# Altium project BMS.PrjPcb (part 2 of 2)

## Sheet Connectors.SchDoc: Connectors
size Letter; DrawnBy: Ayesha Ebrahim; Organization: UW Robotics; Address1: 200 University Avenue; Address2: Waterloo; Address3: Ontario; Address4: Canada N2L 3G6; SheetNumber: 2; SheetTotal: 6
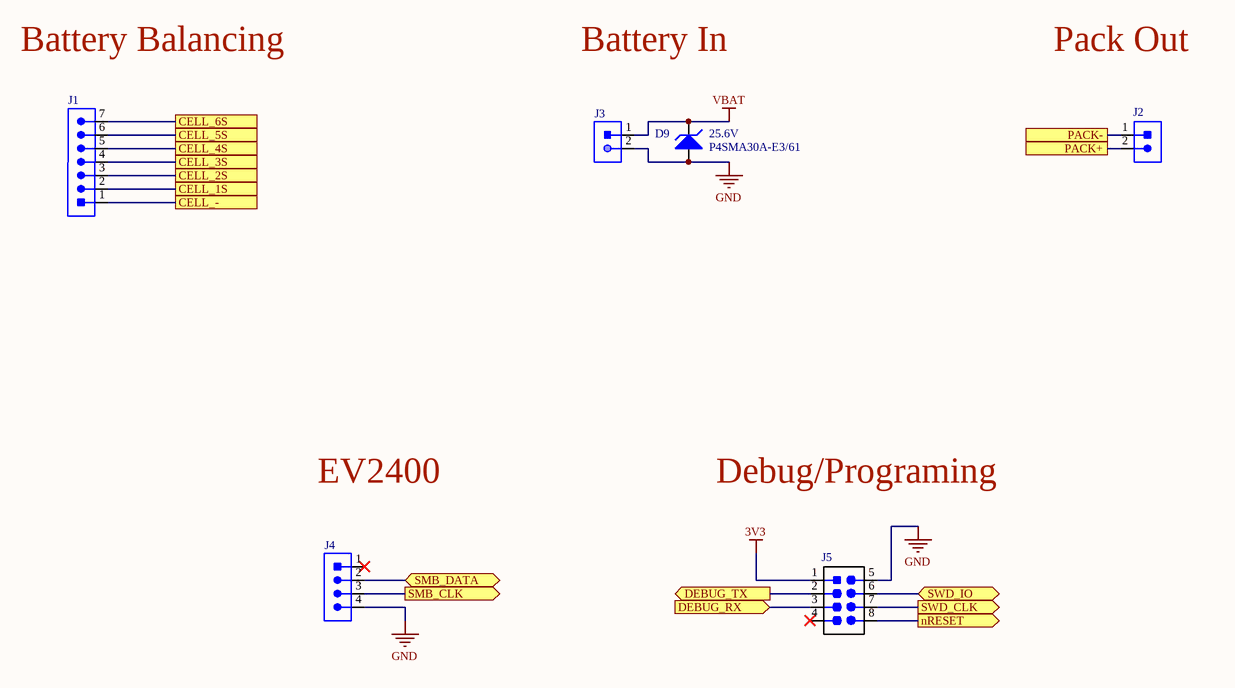
[diagram p3: Connectors.SchDoc]

### Parts
D9  Reverse Standoff Voltage: 25.6V  [DO-214AC_UNI]  (hidden comment: P4SMA30A-E3/61)
J1  CON_7M_TH_RA  [JST_S7B-XH-A(LF)(SN)]  (value not drawn)
J2  SCREW_TERM_115A  [MOLEX-0399200302]  (value not drawn)
J3  XT90  [XT90]  (value not drawn)
J4  CON_4M_TH_RA  [MOLEX-22-05-3041_V]  (value not drawn)
J5  HEADER 4X2  [HEADER_2X4]  (value not drawn)

### Ports
CELL_1S, CELL_2S, CELL_3S, CELL_4S, CELL_5S, CELL_6S, CELL_-, DEBUG_RX (in), DEBUG_TX (out), nRESET (out), PACK+, PACK-, SMB_CLK (out), SMB_DATA (bidir), SWD_CLK (out), SWD_IO (bidir)

### Nets
3V3: J5.1(VCC)
GND: D9.1 J1.1 J3.2 J4.4 J5.5(GND) ; port CELL_-
VBAT: D9.2 J1.7 J3.1 ; port CELL_6S
CELL_1S: J1.2 ; port CELL_1S
CELL_2S: J1.3 ; port CELL_2S
CELL_3S: J1.4 ; port CELL_3S
CELL_4S: J1.5 ; port CELL_4S
CELL_5S: J1.6 ; port CELL_5S
DEBUG_RX: J5.3 ; port DEBUG_RX
DEBUG_TX: J5.2 ; port DEBUG_TX
nRESET: J5.8 ; port nRESET
PACK+: J2.2 ; port PACK+
PACK-: J2.1 ; port PACK-
SMB_CLK: J4.3 ; port SMB_CLK
SMB_DATA: J4.2 ; port SMB_DATA
SWD_CLK: J5.7 ; port SWD_CLK
SWD_IO: J5.6 ; port SWD_IO

Not connected (* = marked no-connect by the designer): J4 1*; J5 4*

### Notes on the sheet
- Battery Balancing
- Battery In
- Pack Out
- EV2400
- Debug/Programing
- Title
- Size:
- Date:
- Letter
- Drawn By:
- Sheet
- of
- File:

### Library data of the parts
D9 = P4SMA30A-E3/61: TVS DIODE, 400W, 25.6V, UNI, DO-214AC; Manufacturer 1: Vishay Semiconductors; Element Configuration: Single; Leakage Current: 1uA; Direction: Unidirectional; Reverse Breakdown Voltage: 28.5V; Max Surge Current: 40A; Number of Unidirectional Channels: 1; Clamping Voltage: 41.4V; Power Line Protection: No; Test Current: 1mA; Peak Pulse Current: 9.7A; Supplier 1: Digi-Key; RoHS: Yes; Category: TVS Diodes; Stock 1: 1849; Pricing 1: 1=0.35000, 10=0.28400, 25=0.26000, 100=0.16340, 250=0.16152, 500=0.15126 (USD); Mount: Surface Mount; Case/Package: SMA; Number of Pins: 2; Min Operating Temperature: -65°C; Max Operating Temperature: 150°C; Max Power Dissipation: 400W; Composition: Zener; Packaging: Tape and Reel; Package Quantity: 1800; Operating Supply Voltage: 25.6V; Polarity: Unidirectional; Min Breakdown Voltage: 28.5V; Peak Pulse Power: 400W; Breakdown Voltage: 28.5V; Number of Channels: 1; Max Reverse Leakage Current: 1uA; Number of Elements: 1; ComponentLink1URL: https://datasheet.ciiva.com:443/pdfs/VipMasterIC/IC/VISH/VISH-S-A0008073361/VISH-S-A0008073361-1.pdf?src-supplier=IHS+Markit; ComponentLink1Description: https://datasheet.ciiva.com:443/pdfs/VipMasterIC/IC/VISH/VISH-S-A0008073361/VISH-S-A0008073361-1.pdf?src-supplier=IHS+Markit; ComponentLink2URL: https://datasheet.ciiva.com/343/p4sma-343073.pdf?src-supplier=Digi-Key; ComponentLink2Description: https://datasheet.ciiva.com/343/p4sma-343073.pdf?src-supplier=Digi-Key; Supplier Part Number 1: P4SMA30A-E3/61GICT-ND; Manufacturer Part Number 1: P4SMA30A-E3/61
J1 = CON_7M_TH_RA: CONN HEADER XH SIDE 7POS 2.5MM; Manufacturer 1: JST Sales America Inc.; Manufacturer Part Number 1: S7B-XH-A(LF)(SN); Current Rating: 3A; Voltage Rating: 250V; Contact Resistance: 10mR; Gender: Male; Number of Positions: 7; Insulation Resistance: 1GR; Connector Type: Header,Male Pin; Wire/Cable Gauge: 22AWG; Supplier 1: Digi-Key; RoHS: Yes; Category: Headers and Wire Housings; Pricing 2: 10=1.05000, 100=0.92700, 500=0.83300, 1000=0.81300, 5000=0.74700, 10000=0.69900 (CAD); Mount: Through Hole; Contact Material: Brass; Contact Plating: Tin,Lead; Color: Natural; Contact Shape: Square; Insulation Material: Nylon; Insulation Color: Natural; Min Operating Temperature: -25°C; Max Operating Temperature: 85°C; Number of Rows: 1; Voltage Rating (AC): 250V; Package Quantity: 250; Packaging: Bulk; Orientation: Right Angle; Fastening Type: Detent; Termination: Solder; Number of Contacts: 7; Pitch: 2.5mm; Lead Pitch: 2.5mm; REACH SVHC: No SVHC; Flammability Rating: UL94 V-0; Lead Free: Lead Free; ComponentLink1URL: https://datasheet.ciiva.com/726/exh-726397.pdf?src-supplier=Digi-Key; ComponentLink1Description: https://datasheet.ciiva.com/726/exh-726397.pdf?src-supplier=Digi-Key; ComponentLink2URL: https://datasheet.ciiva.com/8052/5448-8052233.pdf?src-supplier=Element14; ComponentLink2Description: https://datasheet.ciiva.com/8052/5448-8052233.pdf?src-supplier=Element14; ComponentLink3URL: https://datasheet.ciiva.com/16484/exh-16484539.pdf?src-supplier=Future+Electronics; ComponentLink3Description: https://datasheet.ciiva.com/16484/exh-16484539.pdf?src-supplier=Future+Electronics; Supplier Part Number 1: 455-2240-ND
J2 = SCREW_TERM_115A: CONN TERM BLOCK 2POS 15MM 1-8AWG; Manufacturer 1: Molex; Manufacturer Part Number 1: 0399200302; Plating: Brass,Bronze,Tin; Number of Levels: 1; Number of Positions Per Level: 2; Current: 115A; Voltage: 600V; Pitch: 0.591inch; Wire Gauge (Max): 8AWG; Wire Gauge (Min): 1AWG; Supplier 1: Digi-Key; Supplier Part Number 1: WM20114-ND; RoHS: Yes; Category: Terminal Blocks; Stock 2: 268; Pricing 2: 1=9.66000, 10=8.27400, 25=7.89600, 50=7.09800, 100=6.72000, 250=6.09000, 500=5.67000, 1000=5.35500, 5000=5.04000 (USD); Mount: Through Hole; Housing Material: Polybutylene; Contact Material: Copper; Color: Black; Contact Plating: Copper,Tin,Bright; Housing Color: Black; Min Operating Temperature: -40°C; Max Operating Temperature: 130°C; Termination: Solder; Packaging: Bulk; Number of Rows: 1; Orientation: Straight; Number of Circuits: 2; Number of Contacts: 2; Max Supply Voltage (AC): 600V; Max Voltage Rating (AC): 600V; Length: 32mm; Depth: 20.32mm; Radiation Hardening: No; ComponentLink1URL: https://datasheet.ciiva.com/6751/399200305-sd-6751818.pdf?src-supplier=Digi-Key; ComponentLink1Description: https://datasheet.ciiva.com/6751/399200305-sd-6751818.pdf?src-supplier=Digi-Key
J3 = XT90: HIGH QUALITY GOLD PLATED XT90 MA; Manufacturer 1: DFRobot; Manufacturer Part Number 1: FIT0588; Supplier 1: Digi-Key; Supplier Part Number 1: 1738-1438-ND
J4 = CON_4M_TH_RA: CONN HEADER R/A 4POS 2.54MM; Manufacturer 1: Molex; Number of Contacts: 4; Contact Resistance: 10mR; Gender: Male; Max Current Rating: 4A; Voltage Rating: 250V; Insulation Resistance: 50GR; Approvals: UL,CSA; Glow Wire Compliant: Non-compliant; Supplier 1: Digi-Key; Supplier Part Number 1: WM4302-ND; Manufacturer Part Number 1: 22-05-3041; RoHS: Yes; Category: Headers and Wire Housings; Stock 2: 1752; Pricing 2: 1=0.51000, 10=0.47800, 100=0.36620, 500=0.31840, 1000=0.26268, 5000=0.23084, 10000=0.21492 (USD); Mount: Through Hole; Contact Plating: Tin,Copper; Contact Material: Brass; Color: White; Housing Color: White; Housing Material: Nylon; Min Operating Temperature: 0°C; Max Operating Temperature: 75°C; Number of Rows: 1; Termination: Through Hole; Orientation: Right Angle; Packaging: Bulk; Current Rating: 4A; Package Quantity: 12000; Contact Gender: Male; Number of Positions: 4; Voltage Rating (DC): 250V; Number of Circuits: 4; Length: 10.16mm; Height: 6.35mm; Pitch: 2.54mm; Depth: 12.83mm; Radiation Hardening: No; REACH SVHC: Unknown; Halogen Free: Low Halogen; Lead Free: Lead Free; Flammability Rating: UL94 V-0; ComponentLink1URL: https://datasheet.ciiva.com/7106/1710343-7106224.pdf?src-supplier=Newark; ComponentLink1Description: https://datasheet.ciiva.com/7106/1710343-7106224.pdf?src-supplier=Newark; ComponentLink2URL: https://datasheet.ciiva.com/19462/233453-19462483.pdf?src-supplier=Jameco; ComponentLink2Description: https://datasheet.ciiva.com/19462/233453-19462483.pdf?src-supplier=Jameco; ComponentLink3URL: https://datasheet.ciiva.com/10090/0022053041-pcb-headers-10090549.pdf?src-supplier=Avnet; ComponentLink3Description: https://datasheet.ciiva.com/10090/0022053041-pcb-headers-10090549.pdf?src-supplier=Avnet; ComponentLink4URL: https://datasheet.ciiva.com/5153/0022053041-pcb-headers-158631-5153963.pdf?src-supplier=Mouser; ComponentLink4Description: https://datasheet.ciiva.com/5153/0022053041-pcb-headers-158631-5153963.pdf?src-supplier=Mouser; ComponentLink5URL: https://datasheet.ciiva.com/11746/0900766b80d8f337-11746364.pdf?src-supplier=RSComponents; ComponentLink5Description: https://datasheet.ciiva.com/11746/0900766b80d8f337-11746364.pdf?src-supplier=RSComponents; ComponentLink6URL: https://datasheet.ciiva.com/3933/302090022053041-pcb-headers-3933101.pdf?src-supplier=Arrow; ComponentLink6Description: https://datasheet.ciiva.com/3933/302090022053041-pcb-headers-3933101.pdf?src-supplier=Arrow; ComponentLink7URL: https://datasheet.ciiva.com/19462/1965841-19462350.pdf?src-supplier=Jameco; ComponentLink7Description: https://datasheet.ciiva.com/19462/1965841-19462350.pdf?src-supplier=Jameco; ComponentLink8URL: https://datasheet.ciiva.com/7843/1631486-7843895.pdf?src-supplier=Element14; ComponentLink8Description: https://datasheet.ciiva.com/7843/1631486-7843895.pdf?src-supplier=Element14; ComponentLink9URL: https://datasheet.ciiva.com/16656/0022053041-pcb-headers-16656124.pdf?src-supplier=Avnet+Europe; ComponentLink9Description: https://datasheet.ciiva.com/16656/0022053041-pcb-headers-16656124.pdf?src-supplier=Avnet+Europe
J5 = HEADER 4X2: CONN HEADER VERT 8POS 2.54MM; Manufacturer Part Number 1: M20-9980445; Manufacturer 1: Harwin Inc.; Supplier Part Number 1: 952-2122-ND; Supplier 1: Digi-Key; Mount: Through Hole

## Sheet SD Card.SchDoc: SD Card
size Letter; DrawnBy: Ayesha Ebrahim; SheetNumber: 6; SheetTotal: 6
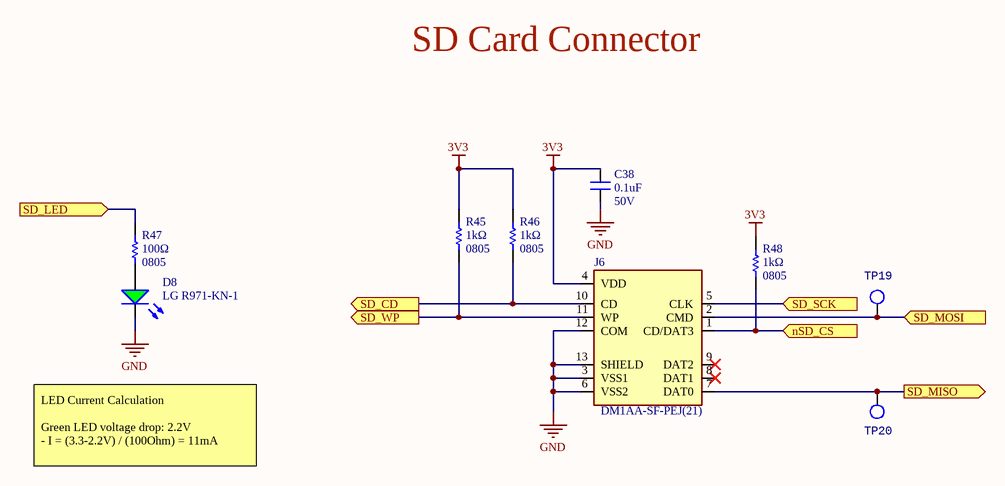
[diagram p4: SD Card.SchDoc]

### Parts
C38  value 0.1uF  Voltage Rating: 50V  [CAPC2012X140N]  (hidden comment: CAP_0.1uF_50V_0805)
D8  Manufacturer Part Number 1: LG R971-KN-1  [LED_0805_LINE]  (hidden comment: DIO_LED_G)
J6  Manufacturer Part Number 1: DM1AA-SF-PEJ(21)  [HRS_DM1AA-SF-PEJ(21)]  (hidden comment: SD_CARD_CON)
R45  value 1kΩ  Case Code (Imperial): 0805  [RESC2012X60N]  (hidden comment: RES_1kΩ_0805)
R46  value 1kΩ  Case Code (Imperial): 0805  [RESC2012X60N]  (hidden comment: RES_1kΩ_0805)
R47  value 100Ω  Case Code (Imperial): 0805  [RESC2012X60N]  (hidden comment: RES_100Ω_0805)
R48  value 1kΩ  Case Code (Imperial): 0805  [RESC2012X60N]  (hidden comment: RES_1kΩ_0805)
TP19  TESTPOINT_LOOP  [TESTPOINT_LOOP]  (value not drawn)
TP20  TESTPOINT_LOOP  [TESTPOINT_LOOP]  (value not drawn)

### Ports
nSD_CS (in), SD_CD (out), SD_LED (in), SD_MISO (out), SD_MOSI (in), SD_SCK (in), SD_WP (out)

### Nets
3V3: C38.2 J6.4(VDD) R45.2 R46.2 R48.2
GND: C38.1 D8.2(K) J6.3(VSS1) J6.6(VSS2) J6.12(COM) J6.13(SHIELD)
nSD_CS: J6.1(CD/DAT3) R48.1 ; port nSD_CS
SD_CD: J6.10(CD) R46.1 ; port SD_CD
SD_LED: R47.2 ; port SD_LED
SD_MISO: J6.7(DAT0) TP20.1 ; port SD_MISO
SD_MOSI: J6.2(CMD) TP19.1 ; port SD_MOSI
SD_SCK: J6.5(CLK) ; port SD_SCK
SD_WP: J6.11(WP) R45.1 ; port SD_WP
NetD8_1: D8.1(A) R47.1

Not connected (* = marked no-connect by the designer): J6 8(DAT1)* 9(DAT2)*

### Notes on the sheet
- SD Card Connector
- LED Current Calculation
  Green LED voltage drop: 2.2V
  - I = (3.3-2.2V) / (100Ohm) = 11mA
- Title
- Size:
- Date:
- Letter
- Drawn By:
- Sheet
- of
- File:

### Library data of the parts
C38 = CAP_0.1uF_50V_0805: CAP CER 0.1UF 50V X7R 0805; Manufacturer 1: Murata Electronics; Manufacturer Part Number 1: GCD21BR71H104KA01L; Capacitance: 100nF; Tolerance: 10%; Mount: Surface Mount; Case/Package: 0805; Case Code (Metric): 2012; Case Code (Imperial): 0805; Min Operating Temperature: -55°C; Max Operating Temperature: 125°C; Dielectric: X7R; Termination: SMD/SMT; Length: 2mm; Height: 1.25mm; Width: 0.049inch; Thickness: 0.049inch; Depth: 1.25mm; Ratings: AEC-Q200; ComponentLink1URL: https://datasheet.ciiva.com/29537/c03e-29537701.pdf?src-supplier=Digi-Key; ComponentLink1Description: https://datasheet.ciiva.com/29537/c03e-29537701.pdf?src-supplier=Digi-Key; Supplier 1: Digi-Key; Supplier Part Number 1: 490-11955-1-ND
D8 = DIO_LED_G: LED GREEN DIFFUSED 0805 SMD; Manufacturer 1: OSRAM; Forward Voltage Drop: 2.2V; Package: 0805 (2012 Metric); Supplier Part Number 1: 475-1410-1-ND; Supplier 1: Digi-Key; Mount: Surface Mount
J6 = SD_CARD_CON: 12 _9 + 3_ Position Card Connector Secure Digital - SD Surface Mount, Right Angle Gold; Manufacturer 1: Hirose Electric Co Ltd; Supplier 1: Digi-Key; Supplier Part Number 1: HR845CT-ND; Mount: Surface Mount; Card Type: SD
R45 R46 R48 = RES_1kΩ_0805: RES SMD 1K OHM 1% 1/8W 0805; Manufacturer 1: Yageo; Manufacturer Part Number 1: RC0805FR-071KL; Power Rating: 125mW; Supplier 1: Digi-Key; Case Code (Metric): 2012; Min Operating Temperature: -55°C; Max Operating Temperature: 155°C; Resistance: 1K; Tolerance: 1%; Termination: SMD/SMT; Supplier Part Number 1: 311-1.00KCRCT-ND
R47 = RES_100Ω_0805: RES SMD 100 OHM 1% 1/8W 0805; Manufacturer 1: Yageo; Manufacturer Part Number 1: RC0805FR-07100RL; Power Rating: 125mW; Supplier 1: Digi-Key; Mount: Surface Mount; Case Code (Metric): 2012; Supplier Part Number 1: 311-100CRCT-ND
TP19 TP20 = TESTPOINT_LOOP: Loop testpoint through-hole pad; Manufacturer Part Number 1: 5002; Manufacturer 1: Keystone Electronics; Supplier Part Number 1: 36-5002-ND; Supplier 1: Digi-Key; Mount: Through Hole

## Sheet LCD.SchDoc: LCD
size Letter; Author: Ayesha Ebrahim; DrawnBy: Ayesha Ebrahim; SheetNumber: 3
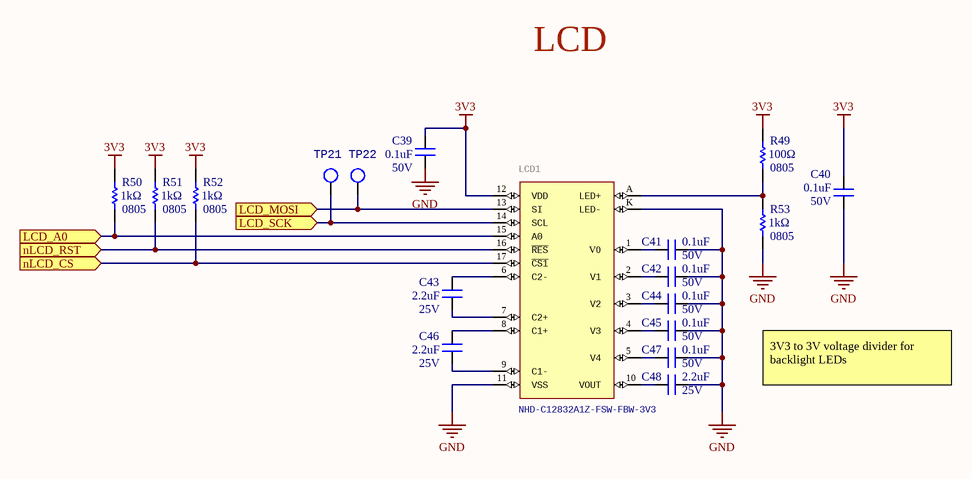
[diagram p5: LCD.SchDoc]

### Parts
C39  value 0.1uF  Voltage Rating: 50V  [CAPC2012X140N]  (hidden comment: CAP_0.1uF_50V_0805)
C40  value 0.1uF  Voltage Rating: 50V  [CAPC2012X140N]  (hidden comment: CAP_0.1uF_50V_0805)
C41  value 0.1uF  Voltage Rating: 50V  [CAPC2012X140N]  (hidden comment: CAP_0.1uF_50V_0805)
C42  value 0.1uF  Voltage Rating: 50V  [CAPC2012X140N]  (hidden comment: CAP_0.1uF_50V_0805)
C43  value 2.2uF  Voltage Rating: 25V  [CAPC2012X140N]  (hidden comment: CAP_2.2uF_25V_0805)
C44  value 0.1uF  Voltage Rating: 50V  [CAPC2012X140N]  (hidden comment: CAP_0.1uF_50V_0805)
C45  value 0.1uF  Voltage Rating: 50V  [CAPC2012X140N]  (hidden comment: CAP_0.1uF_50V_0805)
C46  value 2.2uF  Voltage Rating: 25V  [CAPC2012X140N]  (hidden comment: CAP_2.2uF_25V_0805)
C47  value 0.1uF  Voltage Rating: 50V  [CAPC2012X140N]  (hidden comment: CAP_0.1uF_50V_0805)
C48  value 2.2uF  Voltage Rating: 25V  [CAPC2012X140N]  (hidden comment: CAP_2.2uF_25V_0805)
LCD1  NHD-C12832A1Z-FSW-FBW-3V3  [NHDC12832A1ZFSWFBW3V3]
R49  value 100Ω  Case Code (Imperial): 0805  [RESC2012X60N]  (hidden comment: RES_100Ω_0805)
R50  value 1kΩ  Case Code (Imperial): 0805  [RESC2012X60N]  (hidden comment: RES_1kΩ_0805)
R51  value 1kΩ  Case Code (Imperial): 0805  [RESC2012X60N]  (hidden comment: RES_1kΩ_0805)
R52  value 1kΩ  Case Code (Imperial): 0805  [RESC2012X60N]  (hidden comment: RES_1kΩ_0805)
R53  value 1kΩ  Case Code (Imperial): 0805  [RESC2012X60N]  (hidden comment: RES_1kΩ_0805)
TP21  TESTPOINT_LOOP  [TESTPOINT_LOOP]  (value not drawn)
TP22  TESTPOINT_LOOP  [TESTPOINT_LOOP]  (value not drawn)

### Ports
LCD_A0 (in), LCD_MOSI (in), LCD_SCK (in), nLCD_CS (in), nLCD_RST (in)

### Nets
3V3: C39.1 C40.1 LCD1.12(VDD) R49.2 R50.2 R51.2 R52.2
GND: C39.2 C40.2 C41.1 C42.1 C44.1 C45.1 C47.1 C48.1 LCD1.11(VSS) LCD1.K(LED-) R53.1
LCD_A0: LCD1.15(A0) R50.1 ; port LCD_A0
LCD_MOSI: LCD1.13(SI) TP22.1 ; port LCD_MOSI
LCD_SCK: LCD1.14(SCL) TP21.1 ; port LCD_SCK
nLCD_CS: LCD1.17(~{CS1}) R52.1 ; port nLCD_CS
nLCD_RST: LCD1.16(~{RES}) R51.1 ; port nLCD_RST
NetC41_2: C41.2 LCD1.1(V0)
NetC42_2: C42.2 LCD1.2(V1)
NetC43_1: C43.1 LCD1.7(C2+)
NetC43_2: C43.2 LCD1.6(C2-)
NetC44_2: C44.2 LCD1.3(V2)
NetC45_2: C45.2 LCD1.4(V3)
NetC46_1: C46.1 LCD1.9(C1-)
NetC46_2: C46.2 LCD1.8(C1+)
NetC47_2: C47.2 LCD1.5(V4)
NetC48_2: C48.2 LCD1.10(VOUT)
NetLCD1_A: LCD1.A(LED+) R49.1 R53.2

### Notes on the sheet
- LCD
- 3V3 to 3V voltage divider for backlight LEDs
- Title
- Size:
- Date:
- Letter
- Drawn By:
- Sheet
- of
- File:

### Library data of the parts
C39-C42 C44 C45 C47 = CAP_0.1uF_50V_0805: as C38 on sheet SD Card; Mount: Surface Mount; Case/Package: 0805; Case Code (Metric): 2012; Case Code (Imperial): 0805; Min Operating Temperature: -55°C; Max Operating Temperature: 125°C; Dielectric: X7R; Termination: SMD/SMT; Length: 2mm; Height: 1.25mm; Width: 0.049inch; Thickness: 0.049inch; Depth: 1.25mm; Ratings: AEC-Q200; ComponentLink1URL: https://datasheet.ciiva.com/29537/c03e-29537701.pdf?src-supplier=Digi-Key; ComponentLink1Description: https://datasheet.ciiva.com/29537/c03e-29537701.pdf?src-supplier=Digi-Key; Supplier 1: Digi-Key; Supplier Part Number 1: 490-11955-1-ND
C43 C46 C48 = CAP_2.2uF_25V_0805: CAP CER 2.2UF 25V X7R 0805; Manufacturer 1: Murata Electronics; Manufacturer Part Number 1: GRM21BR71E225KA73L; Capacitance: 2200nF; Tolerance: 10%; Mount: Surface Mount; Case/Package: 0805; Case Code (Metric): 2012; Case Code (Imperial): 0805; Min Operating Temperature: -55°C; Max Operating Temperature: 125°C; Dielectric: X7R; Termination: SMD/SMT; Length: 2mm; Height: 1.25mm; Width: 0.049inch; Thickness: 0.049inch; Depth: 1.25mm; Ratings: AEC-Q200; Supplier 1: Digi-Key; Supplier Part Number 1: 490-3331-2-ND
LCD1 = NHD-C12832A1Z-FSW-FBW-3V3: LCD COG GRAPHIC 128X32; Manufacturer 1: Newhaven Display Intl; Supplier 1: Digi-Key; Supplier Part Number 1: NHD-C12832A1Z-FSW-FBW-3V3-ND; Manufacturer Part Number 1: NHD-C12832A1Z-FSW-FBW-3V3
R49 = RES_100Ω_0805: as R47 on sheet SD Card; Supplier 1: Digi-Key; Mount: Surface Mount; Case Code (Metric): 2012; Supplier Part Number 1: 311-100CRCT-ND
R50-R53 = RES_1kΩ_0805: as R45 on sheet SD Card; Supplier 1: Digi-Key; Case Code (Metric): 2012; Min Operating Temperature: -55°C; Max Operating Temperature: 155°C; Resistance: 1K; Tolerance: 1%; Termination: SMD/SMT; Supplier Part Number 1: 311-1.00KCRCT-ND
TP21 TP22 = TESTPOINT_LOOP: as TP19 on sheet SD Card; Supplier Part Number 1: 36-5002-ND; Supplier 1: Digi-Key; Mount: Through Hole

## Nets that join several sheets
3V3: MCU (19 pins), Power (6 pins), Connectors (J5.1), SD Card (5 pins), LCD (7 pins)
GND: MCU (23 pins), Power (9 pins), Battery Manager (31 pins), Connectors (5 pins), SD Card (6 pins), LCD (11 pins)
VBAT: Power (C16.2 S3.1 TP8.1 U2.7), Battery Manager (7 pins), Connectors (D9.2 J1.7 J3.1)
CELL_1S: Battery Manager (R35.1), Connectors (J1.2)
CELL_2S: Battery Manager (R33.1), Connectors (J1.3)
CELL_3S: Battery Manager (R32.1), Connectors (J1.4)
CELL_4S: Battery Manager (R31.1), Connectors (J1.5)
CELL_5S: Battery Manager (R30.1), Connectors (J1.6)
DEBUG_RX: MCU (TP4.1 U1.52), Connectors (J5.3)
DEBUG_TX: MCU (TP3.1 U1.51), Connectors (J5.2)
LCD_A0: MCU (U1.27), LCD (LCD1.15 R50.1)
LCD_MOSI: MCU (U1.23), LCD (LCD1.13 TP22.1)
LCD_SCK: MCU (U1.21), LCD (LCD1.14 TP21.1)
nLCD_CS: MCU (U1.20), LCD (LCD1.17 R52.1)
nLCD_RST: MCU (U1.28), LCD (LCD1.16 R51.1)
nRESET: MCU (R7.1 S1.1), Connectors (J5.8)
nSD_CS: MCU (U1.56), SD Card (J6.1 R48.1)
PACK+: Battery Manager (9 pins), Connectors (J2.2)
PACK-: Battery Manager (C33.1 R43.1 R44.2), Connectors (J2.1)
SD_CD: MCU (U1.42), SD Card (J6.10 R46.1)
SD_LED: MCU (U1.15), SD Card (R47.2)
SD_MISO: MCU (U1.35), SD Card (J6.7 TP20.1)
SD_MOSI: MCU (U1.36), SD Card (J6.2 TP19.1)
SD_SCK: MCU (TP2.1 U1.29), SD Card (J6.5)
SD_WP: MCU (U1.43), SD Card (J6.11 R45.1)
SMB_CLK: MCU (R11.1 TP5.1 U1.41), Battery Manager (R36.1), Connectors (J4.3)
SMB_DATA: MCU (R10.1 TP1.1 U1.40), Battery Manager (R39.1), Connectors (J4.2)
SWD_CLK: MCU (U1.49), Connectors (J5.7)
SWD_IO: MCU (U1.46), Connectors (J5.6)

## Assembly variants
Production: not fitted C2 C3 C5 C6 Q1 Q5 R13 R16 R34 R35 TP21